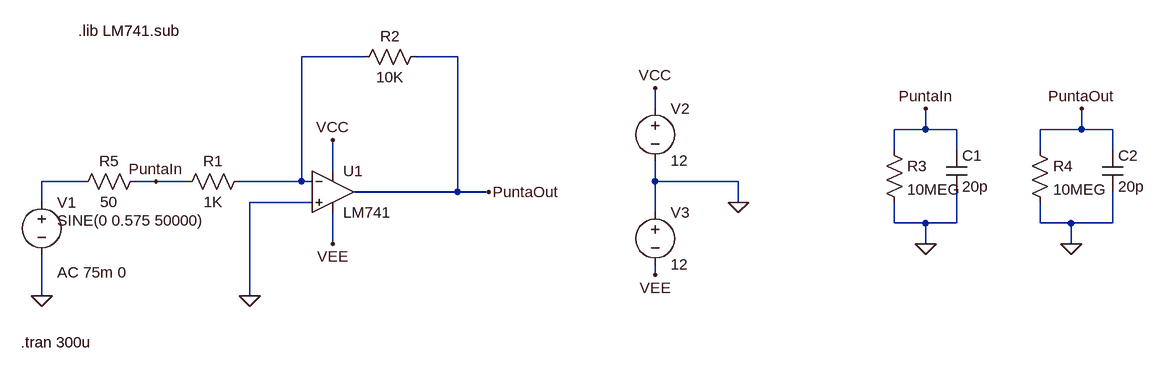
[diagram p0: schematic A2sumo0,5V50Khz.asc]
A2sumo0,5V50Khz.asc, the LTspice schematic file:
Version 4
SHEET 1 1400 680
WIRE 176 16 80 16
WIRE 320 16 256 16
WIRE 624 96 624 64
WIRE 1040 128 1040 96
WIRE 1040 128 992 128
WIRE 1088 128 1040 128
WIRE 1280 128 1280 96
WIRE 1280 128 1216 128
WIRE 1328 128 1280 128
WIRE 992 160 992 128
WIRE 1088 160 1088 128
WIRE 1216 160 1216 128
WIRE 1328 160 1328 128
WIRE 128 192 128 144
WIRE -256 208 -320 208
WIRE -144 208 -176 208
WIRE -96 208 -144 208
WIRE 80 208 80 16
WIRE 80 208 -16 208
WIRE 96 208 80 208
WIRE 624 208 624 176
WIRE 752 208 624 208
WIRE 320 224 320 16
WIRE 320 224 160 224
WIRE 368 224 320 224
WIRE -320 240 -320 208
WIRE 96 240 0 240
WIRE 752 240 752 208
WIRE 624 256 624 208
WIRE 992 272 992 240
WIRE 1040 272 992 272
WIRE 1088 272 1088 224
WIRE 1088 272 1040 272
WIRE 1216 272 1216 240
WIRE 1264 272 1216 272
WIRE 1328 272 1328 224
WIRE 1328 272 1264 272
WIRE 128 304 128 256
WIRE 1040 304 1040 272
WIRE 1264 304 1264 272
WIRE 624 352 624 336
WIRE -320 384 -320 320
WIRE 0 384 0 240
FLAG 0 384 0
FLAG -320 384 0
FLAG 752 240 0
FLAG 624 64 VCC
FLAG 624 352 VEE
FLAG 128 144 VCC
FLAG 128 304 VEE
FLAG 1040 304 0
FLAG 1040 96 PuntaIn
FLAG 1264 304 0
FLAG 1280 96 PuntaOut
FLAG -144 208 PuntaIn
FLAG 368 224 PuntaOut
SYMBOL Opamps\\opamp2 128 160 R0
SYMATTR InstName U1
SYMATTR Value LM741
SYMBOL res 0 192 R90
WINDOW 0 0 56 VBottom 2
WINDOW 3 32 56 VTop 2
SYMATTR InstName R1
SYMATTR Value 1K
SYMBOL res 272 0 R90
WINDOW 0 0 56 VBottom 2
WINDOW 3 32 56 VTop 2
SYMATTR InstName R2
SYMATTR Value 10K
SYMBOL voltage -320 224 R0
WINDOW 123 24 124 Left 2
WINDOW 39 0 0 Left 2
WINDOW 3 24 44 Left 2
SYMATTR Value2 AC 75m 0
SYMATTR Value SINE(0 0.575 50000)
SYMATTR InstName V1
SYMBOL voltage 624 240 R0
SYMATTR InstName V3
SYMATTR Value 12
SYMBOL voltage 624 80 R0
SYMATTR InstName V2
SYMATTR Value 12
SYMBOL res 976 144 R0
SYMATTR InstName R3
SYMATTR Value 10MEG
SYMBOL cap 1072 160 R0
SYMATTR InstName C1
SYMATTR Value 20p
SYMBOL res 1200 144 R0
SYMATTR InstName R4
SYMATTR Value 10MEG
SYMBOL cap 1312 160 R0
SYMATTR InstName C2
SYMATTR Value 20p
SYMBOL res -160 192 R90
WINDOW 0 0 56 VBottom 2
WINDOW 3 32 56 VTop 2
SYMATTR InstName R5
SYMATTR Value 50
TEXT -264 -24 Left 2 !.lib LM741.sub
TEXT -352 456 Left 2 !.tran 300u

The netlist it stands for:
* A2sumo0,5V50Khz.asc
XU1 0 N001 VCC VEE PuntaOut LM741  ; pins In+ In- V+ V- OUT
R1 N001 PuntaIn 1K
R2 PuntaOut N001 10K
V1 N002 0 SINE(0 0.575 50000) AC 75m 0
V3 0 VEE 12
V2 VCC 0 12
R3 PuntaIn 0 10MEG
C1 PuntaIn 0 20p
R4 PuntaOut 0 10MEG
C2 PuntaOut 0 20p
R5 PuntaIn N002 50
.lib LM741.sub
.tran 300u
.backanno
.end